# Altium project Arduino_Zigbee_DHT11.PrjPcb
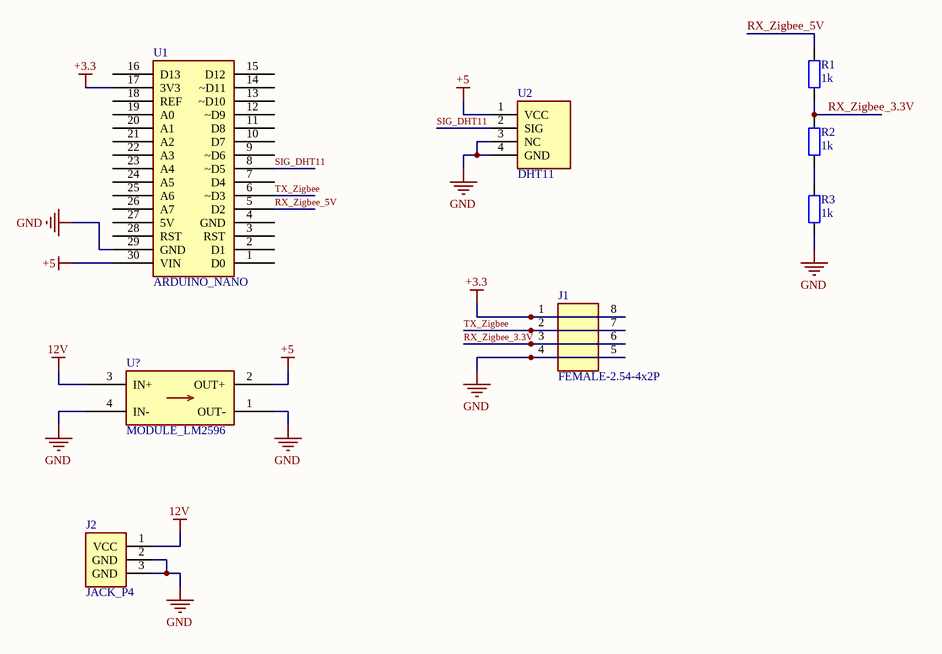
[diagram p0: Nguyen_Ly.SchDoc]
1 sheet, 8 parts. Net scope: global (net labels, ports and power ports of the same name join across sheets).
Board file: Mach_In.PcbDoc

## Sheet Nguyen_Ly.SchDoc
size A4; SheetNumber: 1; SheetTotal: 1

### Parts
J1  FEMALE-2.54-4x2P  [FEMALE-2.54-4x2P]
J2  JACK_P4  [JACK_P4]
R1  1k  [R1/4W]
R2  1k  [R1/4W]
R3  1k  [R1/4W]
U1  ARDUINO_NANO  [ARDUINO_NANO]
U2  DHT11  [DHT11]
U?  MODULE_LM2596  [MODULE_LM2596]

### Nets
12V: J2.1(VCC) U?.3(IN+)
+3.3: J1.1 J1.8 U1.17(3V3)
+5: U1.30(VIN) U2.1(VCC) U?.2(OUT+)
GND: J1.4 J1.5 J2.2(GND) J2.3(GND) R3.1 U1.29(GND) U2.3(NC) U2.4(GND) U?.1(OUT-) U?.4(IN-)
RX_Zigbee_3.3V: J1.3 J1.6 R1.1 R2.2
RX_Zigbee_5V: R1.2 U1.5(D2)
SIG_DHT11: U1.8(~D5) U2.2(SIG)
TX_Zigbee: J1.2 J1.7 U1.6(~D3)
NetR2_1: R2.1 R3.2

Not connected (* = marked no-connect by the designer): U1 1(D0) 2(D1) 3(RST) 4(GND) 7(D4) 9(~D6) 10(D7) 11(D8) 12(~D9) 13(~D10) 14(~D11) 15(D12) 16(D13) 18(REF) 19(A0) 20(A1) 21(A2) 22(A3) 23(A4) 24(A5) 25(A6) 26(A7) 27(5V) 28(RST)

### Library data of the parts
J1 = FEMALE-2.54-4x2P: Female Header Connector 2.54mm 4x2 Pins.; JLCPCB PN: C2977588
J2 = JACK_P4: 9V Battery Connector Jack P4.
R1-R3 = R1/4W: Resistor 1/4W; Value: R1/4W - 1K
U1 = ARDUINO_NANO: Based on ATmega328P, Clock 16MHz, Flash 32KB, 14 Digital Pins, 8 Analog Pins, 5V, Vin 7-12V.; ComponentLink1Description: Datasheet; ComponentLink1URL: https://ww1.microchip.com/downloads/en/DeviceDoc/Atmel-7810-Automotive-Microcontrollers-ATmega328P_Datasheet.pdf
U2 = DHT11: SENSOR HUMIDITY/TEMPERATURE; Digikey PN: 1528-1228-ND
U? = MODULE_LM2596: MODULE BUCK STEP DOWN 3A 43x20mm; ComponentLink1Description: Datasheet; ComponentLink1URL: https://www.ti.com/lit/ds/symlink/lm2596.pdf